# EAGLE design cuff (EAGLE 5.01)
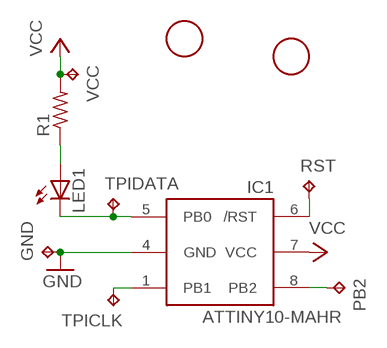
[diagram p0: schematic, sheet 1]

## Parts
GND  TPTP10R  [TP10R]
IC1  ATTINY10-MAHR  [UDFN-8]
LED1  LEDSMLK34  [SMLK34]
PB2  TPTP10R  [TP10R]
R1  R-US_R0805  [R0805]
RST  TPTP10R  [TP10R]
TPICLK  TPTP10R  [TP10R]
TPIDATA  TPTP10R  [TP10R]
U$2  FIDUCIAL  [FIDUCIAL_1MM]
U$3  FIDUCIAL  [FIDUCIAL_1MM]
VCC  TPTP10R  [TP10R]

## Nets
B0: IC1.5(PB0) LED1.K(C) TPIDATA.TP
B1: IC1.1(PB1) TPICLK.TP
B2: IC1.8(PB2) PB2.TP
GND: GND.TP IC1.4(GND)
N$3: LED1.A R1.1
RST: IC1.6(/RST) RST.TP
VCC: IC1.7(VCC) R1.2 VCC.TP

## Library data of the parts
GND PB2 RST TPICLK TPIDATA VCC = testpad:TP: Test pad
IC1 = adafruit:ATTINY10: ATtiny4/5/9/10 8-bit Microcontroller with 512/1024 Bytes In-System Programmable Flash
LED1 = adafruit:LED: LED OSRAM: - CHIPLED LG R971, LG N971, LY N971, LG Q971, LY Q971, LO R971, LY R971 LH N974, LH R974 LS Q976, LO Q976, LY Q976 LO Q996 - Hyper CHIPLED LW Q18S LB Q993, LB Q99A, LB R99A - SideLED LS A670, LO A670, LY A670, LG A670, LP A670 LB A673, LV A673, LT A673, LW A673 LH A674 LY A675 LS A676, LA A676, LO A676, LY A676, LW A676 LS A679, LY A679, LG A679 - Hyper Micro SIDELED® LS Y876, LA Y876, LO Y876, LY Y876 LT Y87S - SmartLED LW L88C, LW L88S LB L89C, LB L89S, LG L890 LS L89K, LO L89K, LY L89K LS L896, LA L896, LO L896, LY L896 - TOPLED LS T670, LO T670, LY T670, LG T670, LP T670 LSG T670, LSP T670, LSY T670, LOP T670, LYG T670 LG T671, LOG T671, LSG T671 LB T673, LV T673, LT T673, LW T673 LH T674 LS T676, LA T676, LO T676, LY T676, LB T676, LH T676, LSB T676, LW T676 LB T67C, LV T67C, LT T67C, LS T67K, LO T67K, LY T67K, LW E67C LS E67B, LA E67B, LO E67B, LY E67B, LB E67C, LV E67C, LT E67C LW T67C LS T679, LY T679, LG T679 LS T770, LO T770, LY T770, LG T770, LP T770 LB T773, LV T773, LT T773, LW T773 LH T774 LS E675, LA E675, LY E675, LS T675 LS T776, LA T776, LO T776, LY T776, LB T776 LHGB T686 LT T68C, LB T68C - Hyper Mini TOPLED® LB M676 - Mini TOPLED Santana® LG M470 LS M47K, LO M47K, LY M47K Source: http://www.osram.convergy.de/
R1 = adafruit:R-US_: RESISTOR, American symbol
U$2 U$3 = adafruit:FIDUCIAL: For use by pick and place machines to calibrate the vision/machine, 1mm By microbuilder.eu

## Board
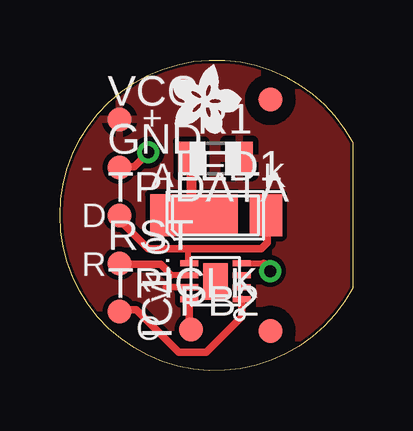
[diagram p1: board, top side]
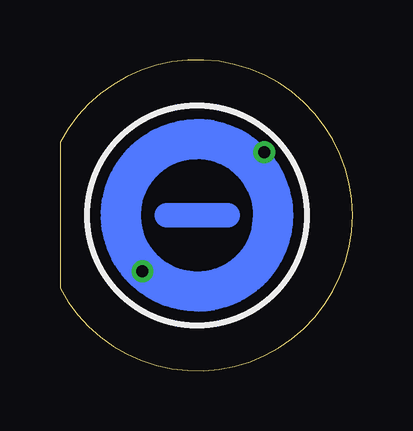
[diagram p2: board, bottom side, seen from below]

Size 12.19 x 12.94 mm. Coordinates in mm from the lower left corner, seen from the top.
Outline: 12.19,9.52 12.19,3.42 arc-304 12.19,9.52
Copper layers (1*16): Top 0.035mm / dielectric 1.5mm / Bottom 0.035mm
Design rules "default *": minimum track width 8mil, minimum drill 19mil, track to track 8mil, track to pad 8mil, pad to pad 8mil, via to via 10mil, smd to smd 8mil, copper to edge 5mil, drill to drill 8mil, minimum pad ring 10mil, minimum via ring 8mil, stop-mask expansion 4mil, vias tented up to drill 20mil, thermal gap 10mil

### Footprints (pad centres in the part's own frame; a part is rotated, then mirrored left to right if it is on the bottom)
TP10R = smd 1 x 1: TP 0,0
UDFN-8 = smd 0.25 x 0.75: 1 -0.75,-1.1; 2 -0.25,-1.1; 3 0.25,-1.1; 4 0.75,-1.1; 5 0.75,1.1; 6 0.25,1.1; 7 -0.25,1.1; 8 -0.75,1.1 | smd 1.524 x 1.016: THERM 0,0
SMLK34 = smd 3.65 x 1.74: A 0.9,0 | smd 1.35 x 1.74: K -2.1,0
R0805 = smd 1.1 x 1.4: 1 -1,0; 2 1,0
FIDUCIAL_1MM = smd 1 x 1: 1 0,0

### Placement (x,y rotation side)
GND  2.48,8.47 0 top
IC1  6.48,3.72 90 top
LED1  6.48,6.47 180 top
PB2  5.46,1.72 0 top
R1  6.48,8.84 0 top
RST  2.48,4.47 0 top
TPICLK  2.48,2.47 0 top
TPIDATA  2.48,6.47 0 top
U$1  [ADAFRUIT200MIL]  6.1,11.42 270 top
U$2  8.76,1.65 0 top
U$3  8.76,11.3 0 top
VCC  2.48,10.47 0 top

### Tracks (layer width: path | path; a pad name or v marks a point on that pad's centre or on a via)
B0
  Top 0.254: IC1.5 5.33,4.51 5.33,5.07
  Top 0.305: LED1.K 8.64,6.47 8.64,5.33 8.38,5.07 5.33,5.07 3.68,5.07 2.48,6.28 TPIDATA.TP
B1
  Top 0.305: IC1.1 7.58,2.24 6.1,0.76 4.95,0.76 3.17,2.53 2.54,2.53 TPICLK.TP
B2
  Top 0.254: 5.38,2.75 IC1.8
  Top 0.305: PB2.TP 5.38,1.85 5.38,2.75
GND  (via drill 0.5)
  Top 0.254: IC1.4 8.48,4.47 | 3.09,8.5 3.09,8.47
  Top 0.305: v8.76,4.14 8.76,4.18 8.76,4.19 8.48,4.47 | 3.68,9.13 3.68,9.14 v3.68,9.1 v3.68,9.09 3.09,8.5 2.51,8.5 GND.TP
  Bottom 0.254: v3.68,9.09 3.68,9.14 | v3.68,9.09 | 3.56,8 3.68,8 v3.68,9.09 | 8.76,4.18 8.76,4.19 | v8.76,4.14 8.76,4.18 | 6.48,3.3 7.87,3.3 8.76,4.18
  Bottom 1.016: 3.3,6.47 3.56,8
  Bottom 1.676: 6.48,3.3 arc-90 3.3,6.47 arc-90 6.48,9.65 arc-90 9.65,6.47 arc-90 6.48,3.3
N$1
  Bottom 1.016: 7.75,6.47 5.21,6.47
N$3
  Top 0.406: LED1.A 5.48,6.58 R1.1
RST
  Top 0.254: IC1.6 4.66,3.97 4.41,4.22
  Top 0.305: RST.TP 2.51,4.44 4.19,4.44 4.41,4.22
VCC
  Top 0.254: IC1.7 4.4,3.47
  pour Top: 6.48,12.97 arc90 -0.02,6.47 arc90 6.48,-0.03 arc90 12.98,6.47 arc90

### Text on the board
tPlace: + | - | D | v1.0 | R | C